# Altium schematic sheet KickTrigger.SchDoc: KickTrigger
size Letter; DocumentNumber: 3; SheetNumber: 3; SheetTotal: 4; Conceptor: Philippe T. Simon B. Léonard G. Alexia B-L.; Version: Gamma 1.0
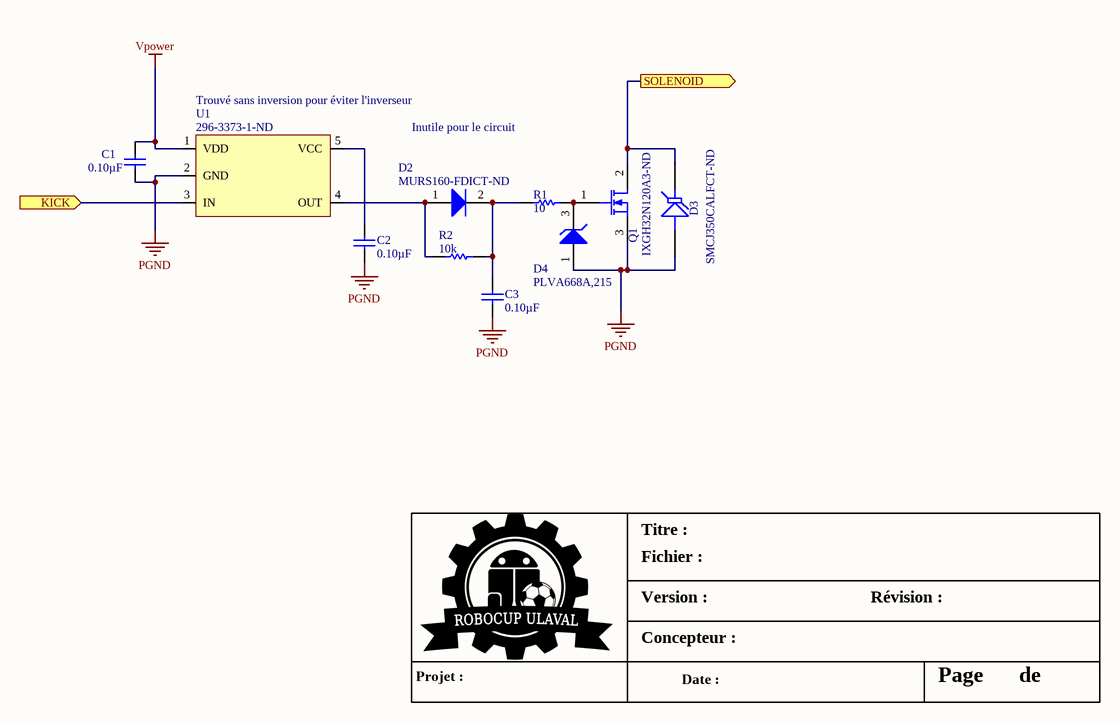
[diagram p0: KickTrigger.SchDoc]

## Parts
C1  Capacitance: 0.10µF  [0603]  (hidden comment: CL10B104KB8SFNC)
C2  Capacitance: 0.10µF  [0603]  (hidden comment: CL10B104KB8SFNC)
C3  Capacitance: 0.10µF  [0603]  (hidden comment: CL10B104KB8SFNC)
D2  Supplier Part Number 1: MURS160-FDICT-ND  [SMB]  (hidden comment: MURS160-13-F)
D3  Supplier Part Number 1: SMCJ350CALFCT-ND  [SMC]  (hidden comment: SMCJ350CA)
D4  PLVA668A,215  [SOT-23-3]
Q1  Supplier Part Number 1: IXGH32N120A3-ND  [TO-247 (bent)]  (hidden comment: IXGH32N120A3)
R1  Resistance (Ohms): 10  [0603]  (hidden comment: RC0603FR-0710RL)
R2  Resistance (Ohms): 10k  [0603]  (hidden comment: RC0603JR-0710KL)
U1  Supplier Part Number 1: 296-3373-1-ND  [SOT-23-5]  (hidden comment: TPS2818DBVR)

## Ports
KICK (in), SOLENOID (out)

## Nets
PGND: C1.2 C2.1 C3.1 D3.1(A) D4.1(A) Q1.3(S) U1.2(GND)
Vpower: C1.1 U1.1(VDD)
KICK: U1.3(IN) ; port KICK
SOLENOID: D3.2(K) Q1.2(D) ; port SOLENOID
NetC2_2: C2.2 U1.5(VCC)
NetC3_2: C3.2 D2.2(K) R1.1 R2.2
NetD2_1: D2.1(A) R2.1 U1.4(OUT)
NetD4_3: D4.3(K) Q1.1(G) R1.2

## Notes on the sheet
- (near U1) Trouvé sans inversion pour éviter l'inverseur
- Inutile pour le circuit
- Titre :
- Version :
- Fichier :
- Révision :
- Projet :
- Concepteur :
- Date :
- Page
- de

## Library data of the parts
C1-C3 = CL10B104KB8SFNC: CAP CER 0.1UF 50V X7R 0603; Manufacturer: Samsung Electro-Mechanics America, Inc.; Tolerance: ±10%; Supplier 1: Digi-Key; Manufacturer Part Number: CL10B104KB8SFNC; RoHS: RoHS Compliant; Category: Capacitors; Stock 1: 2612665; Pricing 1: 1=0.14, 10=0.028, 25=0.0204, 50=0.0156, 100=0.0127, 250=0.01064, 500=0.00908, 1000=0.00712 (CAD); Packaging: Cut Tape (CT); Voltage - Rated: 50V; Temperature Coefficient: X7R; Mounting Type: Surface Mount, MLCC; Operating Temperature: -55°C ~ 125°C; Applications: Boardflex Sensitive; Ratings: -; Package / Case: 0603 (1608 Metric); Size / Dimension: 0.063" L x 0.031" W (1.60mm x 0.80mm); Height - Seated (Max): -; Thickness (Max): 0.035" (0.90mm); Lead Spacing: -; Features: Soft Termination; Lead Style: -; ComponentLink1URL: http://www.samsungsem.com/kr/support/product-search/mlcc/CL10B104KB8SFNC.jsp; ComponentLink1Description: http://www.samsungsem.com/kr/support/product-search/mlcc/CL10B104KB8SFNC.jsp; Supplier Part Number 1: 1276-1936-1-ND
D2 = MURS160-13-F: DIODE GEN PURP 600V 1A SMB; Manufacturer: Diodes Incorporated; Diode Type: Standard; Voltage - Forward (Vf) (Max) @ If: 1.25V @ 1A; Speed: Fast Recovery =< 500ns, > 200mA (Io); Reverse Recovery Time (trr): 50ns; Current - Reverse Leakage @ Vr: 5µA @ 600V; Capacitance @ Vr, F: 10pF @ 4V, 1MHz; Supplier 1: Digi-Key; Manufacturer Part Number: MURS160-13-F; RoHS: RoHS Compliant; Category: Discrete Semiconductor Products; Stock 1: 18621; Pricing 1: 1=0.55, 10=0.445, 100=0.303, 500=0.2268, 1000=0.16986 (CAD); Packaging: Cut Tape (CT); Part Status: Active; Voltage - DC Reverse (Vr) (Max): 600V; Current - Average Rectified (Io): 1A; Mounting Type: Surface Mount; Package / Case: DO-214AA, SMB; Supplier Device Package: SMB; Operating Temperature - Junction: -55°C ~ 175°C; ComponentLink1URL: http://www.diodes.com/_files/datasheets/ds30130.pdf; ComponentLink1Description: http://www.diodes.com/_files/datasheets/ds30130.pdf
D3 = SMCJ350CA: TVS DIODE 350VWM 567VC SMC; Manufacturer: Littelfuse Inc.; Type: Zener; Bidirectional Channels: 1; Voltage - Reverse Standoff (Typ): 350V; Voltage - Breakdown (Min): 391V; Voltage - Clamping (Max) @ Ipp: 567V; Current - Peak Pulse (10/1000µs): 2.6A; Power - Peak Pulse: 1500W (1.5kW); Power Line Protection: No; Supplier 1: Digi-Key; Manufacturer Part Number: SMCJ350CA; RoHS: RoHS Compliant; Category: Circuit Protection; Stock 1: 2977; Pricing 1: 1=1.27, 10=1.122, 25=1.0124, 100=0.8859, 250=0.777, 500=0.68908, 1000=0.54495 (CAD); Packaging: Cut Tape (CT); Part Status: Active; Unidirectional Channels: -; Applications: General Purpose; Capacitance @ Frequency: -; Operating Temperature: -55°C ~ 150°C (TJ); Mounting Type: Surface Mount; Package / Case: DO-214AB, SMC; Supplier Device Package: DO-214AB (SMCJ); ComponentLink1URL: http://www.littelfuse.com/products/tvs-diodes/surface-mount/~/media/electronics/datasheets/tvs_diodes/littelfuse_tvs_diode_smcj_datasheet.pdf.pdf; ComponentLink1Description: http://www.littelfuse.com/products/tvs-diodes/surface-mount/~/media/electronics/datasheets/tvs_diodes/littelfuse_tvs_diode_smcj_datasheet.pdf.pdf
D4 = PLVA668A,215: DIODE ZENER 6.8V 250MW SOT23; Manufacturer: NXP Semiconductors; Tolerance: ±3%; Impedance (Max) (Zzt): 100 Ohm; Current - Reverse Leakage @ Vr: 6nA @ 6.1V; Voltage - Forward (Vf) (Max) @ If: 900mV @ 10mA; Supplier 1: Digi-Key; Manufacturer Part Number: PLVA668A,215; RoHS: RoHS Compliant; Category: Discrete Semiconductor Products; Stock 1: 4213; Pricing 1: 1=0.54, 10=0.407, 100=0.2535, 500=0.17338, 1000=0.13327 (CAD); Packaging: Cut Tape (CT); Part Status: Active; Voltage - Zener (Nom) (Vz): 6.8V; Power - Max: 250mW; Operating Temperature: -65°C ~ 150°C; Mounting Type: Surface Mount; Package / Case: TO-236-3, SC-59, SOT-23-3; Supplier Device Package: SOT-23 (TO-236AB); ComponentLink1URL: http://www.nxp.com/documents/data_sheet/PLVA6XXA_SERIES.pdf; ComponentLink1Description: http://www.nxp.com/documents/data_sheet/PLVA6XXA_SERIES.pdf; Supplier Part Number 1: 568-6474-1-ND
Q1 = IXGH32N120A3: IGBT 1200V 75A 300W TO247; Manufacturer: IXYS; IGBT Type: PT; Current - Collector Pulsed (Icm): 230A; Vce(on) (Max) @ Vge, Ic: 2.35V @ 15V, 32A; Input Type: Standard; Gate Charge: 89nC; Supplier 1: Digi-Key; Manufacturer Part Number: IXGH32N120A3; RoHS: RoHS Compliant; Category: Discrete Semiconductor Products; Stock 1: 13; Pricing 1: 1=10.99, 10=9.885, 25=9.0056, 100=8.1269, 250=7.468, 500=6.80904, 1000=5.93046, 2500=5.71081, 5000=5.49117 (CAD); Packaging: Tube; Part Status: Active; Voltage - Collector Emitter Breakdown (Max): 1200V; Current - Collector (Ic) (Max): 75A; Power - Max: 300W; Switching Energy: -; Td (on/off) @ 25°C: -; Test Condition: -; Reverse Recovery Time (trr): -; Package / Case: TO-247-3; Mounting Type: Through Hole; Supplier Device Package: TO-247AD (IXGH); ComponentLink1URL: http://ixdev.ixys.com/DataSheet/DS99608C(IXGH-GT32N120A3).pdf; ComponentLink1Description: http://ixdev.ixys.com/DataSheet/DS99608C(IXGH-GT32N120A3).pdf
R1 = RC0603FR-0710RL: RES SMD 10 OHM 1% 1/10W 0603; Manufacturer: Yageo; Power (Watts): 0.1W, 1/10W; Temperature Coefficient: ±200ppm/°C; Supplier 1: Digi-Key; Manufacturer Part Number: RC0603FR-0710RL; RoHS: RoHS Compliant; Category: Resistors; Stock 1: 2391720; Pricing 1: 1=0.15, 10=0.021, 25=0.0152, 100=0.0086, 250=0.0066, 500=0.00526, 1000=0.00389, 2500=0.00337 (CAD); Packaging: Cut Tape (CT); Tolerance: ±1%; Composition: Thick Film; Features: Moisture Resistant; Operating Temperature: -55°C ~ 155°C; Package / Case: 0603 (1608 Metric); Supplier Device Package: 0603; Size / Dimension: 0.063" L x 0.031" W (1.60mm x 0.80mm); Height: 0.022" (0.55mm); Number of Terminations: 2; ComponentLink1URL: http://www.yageo.com/documents/recent/PYu-RC_Group_51_RoHS_L_04.pdf; ComponentLink1Description: http://www.yageo.com/documents/recent/PYu-RC_Group_51_RoHS_L_04.pdf; Supplier Part Number 1: 311-10.0HRCT-ND
R2 = RC0603JR-0710KL: RES SMD 10K OHM 5% 1/10W 0603; Manufacturer: Yageo; Power (Watts): 0.1W, 1/10W; Temperature Coefficient: ±100ppm/°C; Supplier 1: Digi-Key; Manufacturer Part Number: RC0603JR-0710KL; RoHS: RoHS Compliant; Category: Resistors; Stock 1: 5547866; Pricing 1: 1=0.15, 10=0.017, 25=0.012, 100=0.0067, 250=0.00508, 500=0.00408, 1000=0.003, 2500=0.0026 (CAD); Packaging: Cut Tape (CT); Tolerance: ±5%; Composition: Thick Film; Features: Moisture Resistant; Operating Temperature: -55°C ~ 155°C; Package / Case: 0603 (1608 Metric); Supplier Device Package: 0603; Size / Dimension: 0.063" L x 0.031" W (1.60mm x 0.80mm); Height: 0.022" (0.55mm); Number of Terminations: 2; ComponentLink1URL: http://www.yageo.com/documents/recent/PYu-RC_Group_51_RoHS_L_04.pdf; ComponentLink1Description: http://www.yageo.com/documents/recent/PYu-RC_Group_51_RoHS_L_04.pdf; Supplier Part Number 1: 311-10KGRCT-ND
U1 = TPS2818DBVR: IC INVERTING FET DRVR SOT-23-5; Manufacturer: Texas Instruments; Driven Configuration: Low-Side; Channel Type: Single; Number of Drivers: 1; Gate Type: N-Channel MOSFET; Voltage - Supply: 4 V ~ 14 V; Logic Voltage - VIL, VIH: 1V, 4V; Current - Peak Output (Source, Sink): 2A, 2A; Rise / Fall Time (Typ): 14ns, 14ns; Supplier 1: Digi-Key; Manufacturer Part Number: TPS2818DBVR; RoHS: RoHS Compliant; Category: Integrated Circuits (ICs); Stock 1: 14841; Pricing 1: 1=2.71, 10=2.43, 100=1.9489, 500=1.6018, 1000=1.32593 (CAD); Packaging: Cut Tape (CT); Part Status: Active; Input Type: Inverting; High Side Voltage - Max (Bootstrap): -; Operating Temperature: -40°C ~ 125°C (TA); Mounting Type: Surface Mount; Package / Case: SC-74A, SOT-753; Supplier Device Package: SOT-23-5; ComponentLink1URL: http://www.ti.com/lit/ds/symlink/tps2816.pdf; ComponentLink1Description: http://www.ti.com/lit/ds/symlink/tps2816.pdf